# Altium schematic sheet Core.SchDoc
size A4
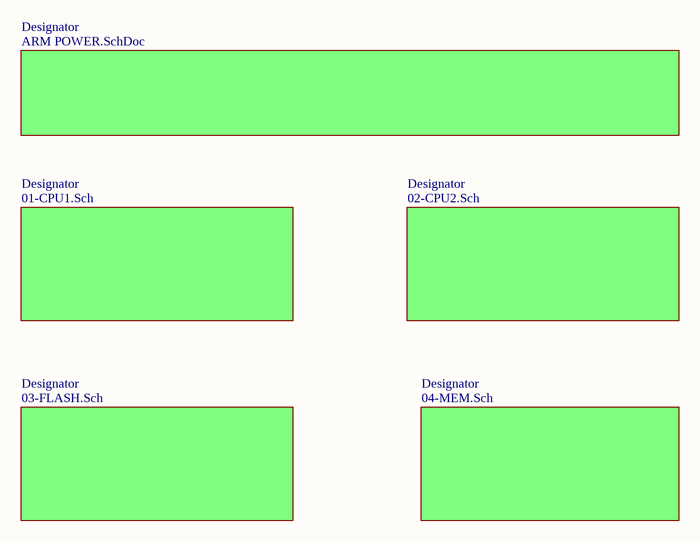
[diagram p0: Core.SchDoc]

## Sub-sheets
Designator = 01-CPU1.Sch: no entries
Designator = 02-CPU2.Sch: no entries
Designator = 04-MEM.Sch: no entries
Designator = ARM POWER.SchDoc: no entries
Designator = 03-FLASH.Sch: no entries